# Altium project SOMO_PowerPack_Top.PrjPcb
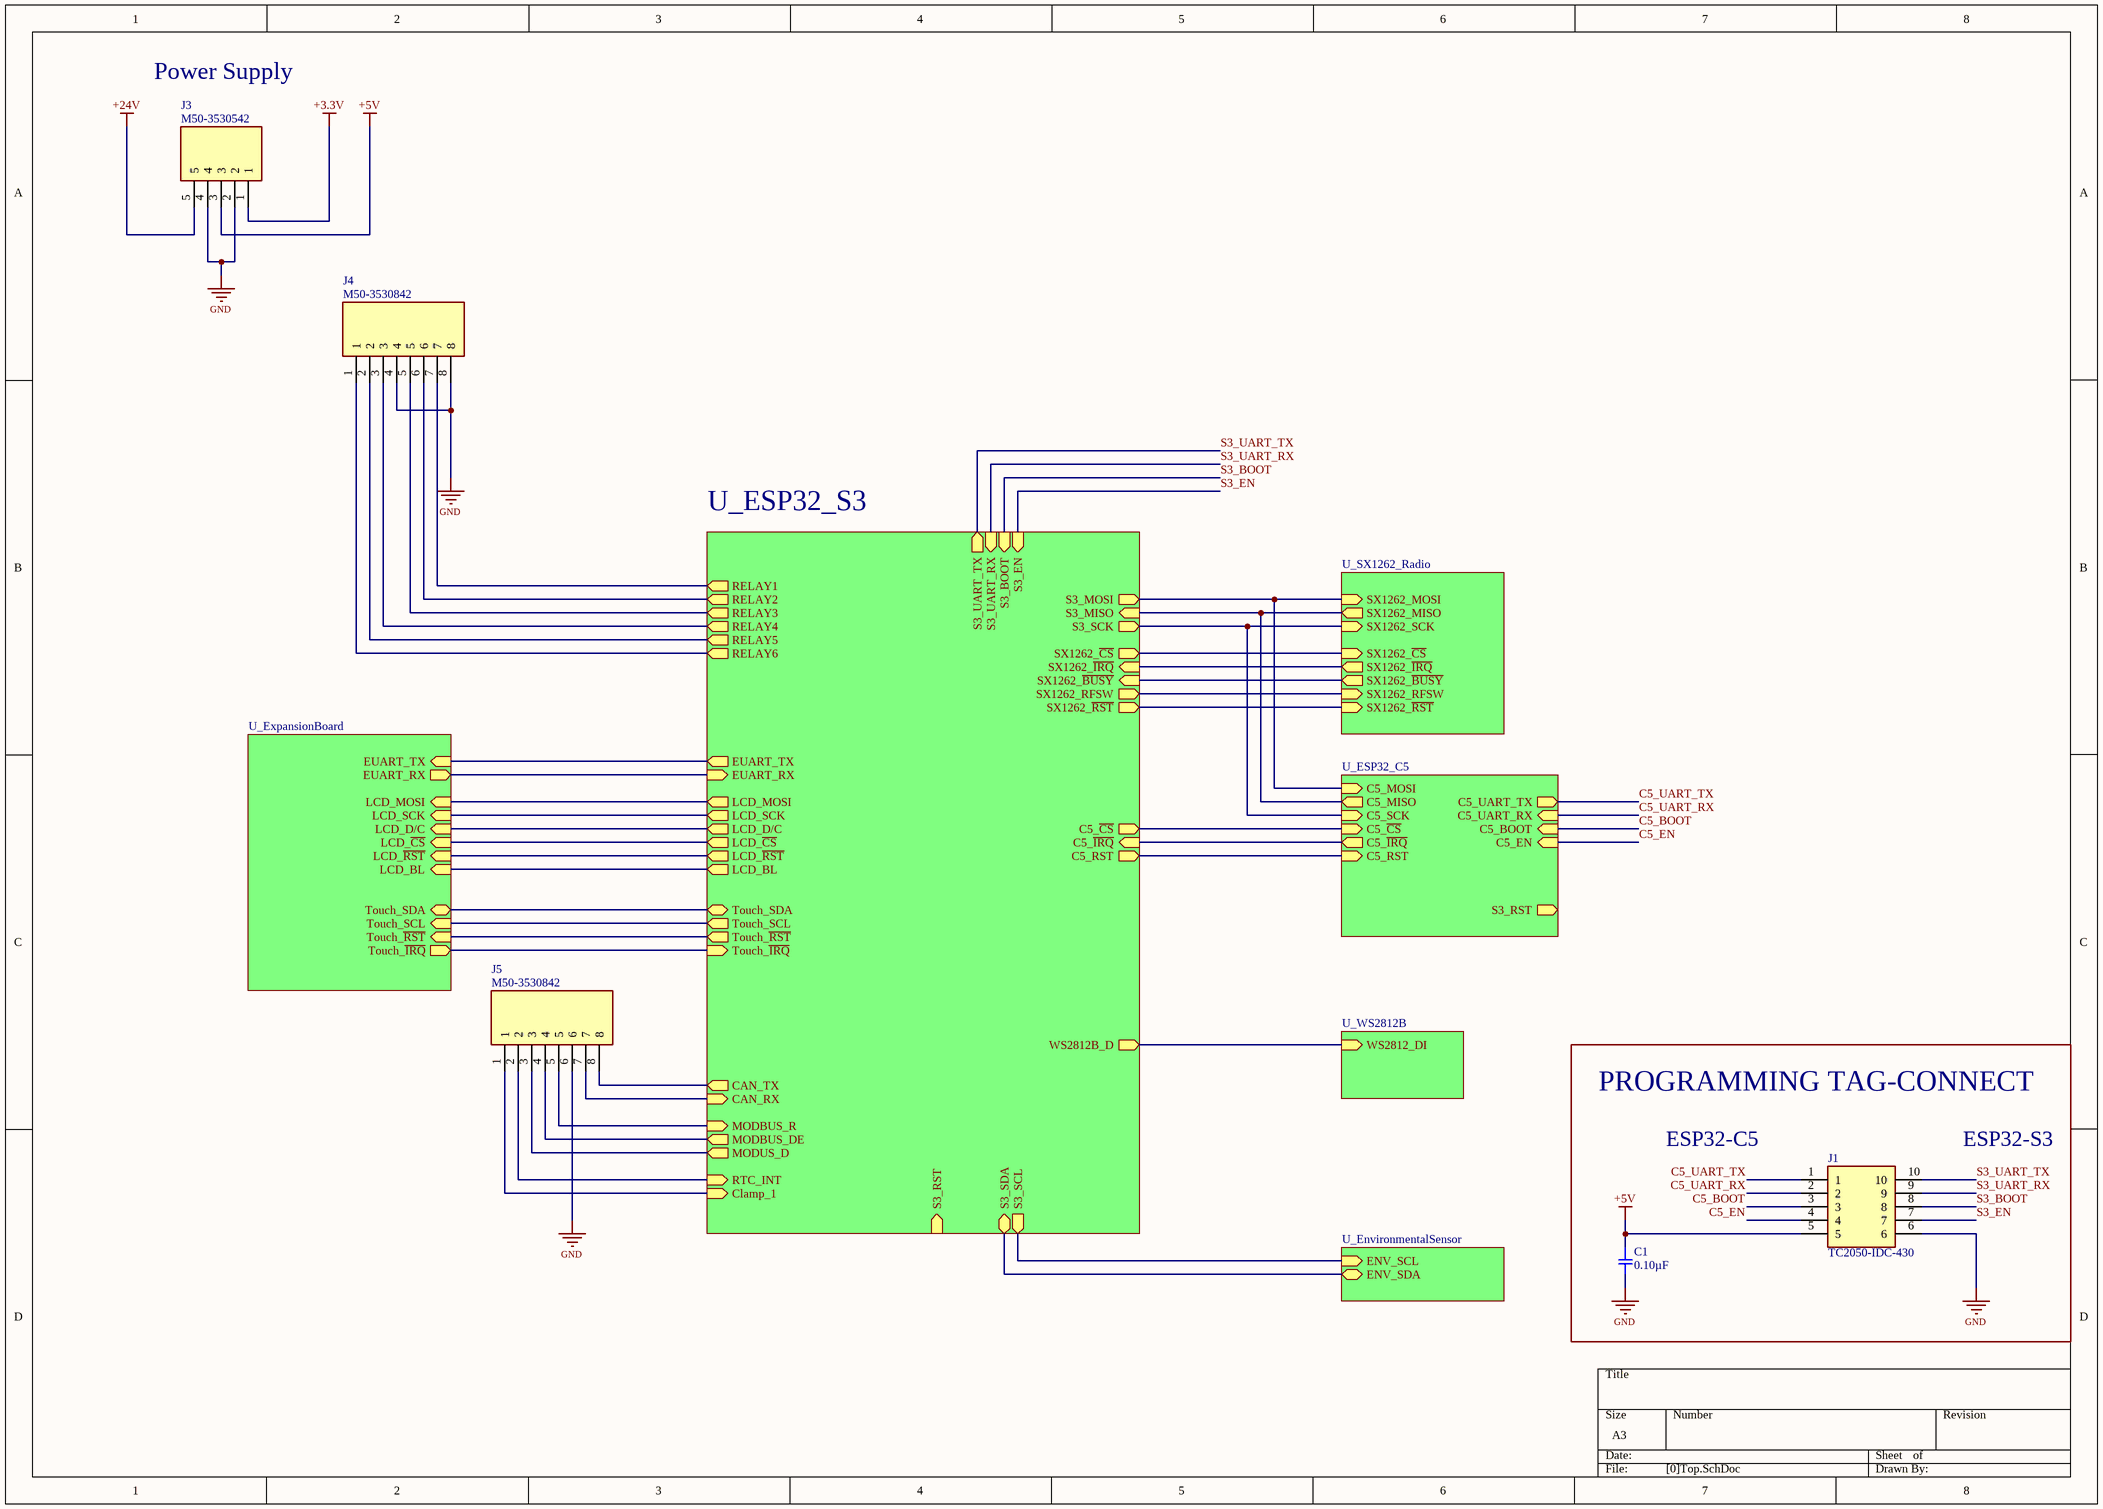
[diagram p0: [0]Top.SchDoc]
9 sheets, 47 parts. Net scope: hierarchical (ports join the sheet entries above them; power ports are global).
Board file: SOMO_PowerPack_Top.PcbDoc
Sheets:
  [0]Top.SchDoc
    U_ESP32_C5 = ESP32_C5.SchDoc
    U_ESP32_S3 = ESP32_S3.SchDoc
      U_GPIO_Expander = GPIO_Expander.SchDoc
    U_SX1262_Radio = SX1262_Radio.SchDoc
    U_ExpansionBoard = ExpansionBoard.SchDoc
    U_WS2812B = WS2812B.SchDoc
    U_EnvironmentalSensor = EnvironmentalSensor.SchDoc
  GPIO_Expander2.SchDoc

## Sheet [0]Top.SchDoc
size A3; SheetNumber: 1; SheetTotal: 8

### Parts
C1  0.10µF  [SMD-0402C]
J1  TC2050-IDC-430  [TC2050-IDC]  (no BOM)
J3  M50-3530542  [HDRV5W40P0X127_1X5_635X210X400P]
J4  M50-3530842  [HDRV8W40P0X127_1X8_1016X210X400P]
J5  M50-3530842  [HDRV8W40P0X127_1X8_1016X210X400P]

### Blocks framed on the sheet
PROGRAMMING TAG-CONNECT: C1 J1

### Sub-sheets
U_EnvironmentalSensor = EnvironmentalSensor.SchDoc: ENV_SCL (in), ENV_SDA (bidir)
U_ESP32_C5 = ESP32_C5.SchDoc: C5_UART_TX (out), S3_RST (out), C5_MOSI (in), C5_MISO (out), C5_SCK (in), C5_~{CS} (in), C5_RST (in), C5_UART_RX (in), C5_BOOT (in), C5_EN (in), C5_~{IRQ} (out)
U_ESP32_S3 = ESP32_S3.SchDoc: Touch_SDA (bidir), Touch_SCL (out), S3_SDA (bidir), EUART_TX (out), EUART_RX (in), LCD_MOSI (out), Touch_~{IRQ} (in), LCD_SCK (out), RELAY1 (out), RELAY2 (out), RELAY3 (out), RELAY4 (out), RELAY5 (out), RELAY6 (out), LCD_~{CS} (out), LCD_D/C (out), LCD_~{RST} (out), Touch_~{RST} (out), LCD_BL (out), S3_MOSI (out), S3_MISO (in), S3_SCK (out), SX1262_~{CS} (out), SX1262_~{IRQ} (in), SX1262_RFSW (out), SX1262_~{RST} (out), S3_UART_TX (out), S3_UART_RX (in), S3_BOOT (in), S3_EN (in), S3_SCL (out), WS2812B_D (out), SX1262_~{BUSY} (in), S3_RST (in), C5_~{CS} (out), C5_~{IRQ} (in), C5_RST (out), CAN_TX (out), CAN_RX (in), MODUS_D (out), MODBUS_DE (out), MODBUS_R (in), RTC_INT (in), Clamp_1 (in)
U_ExpansionBoard = ExpansionBoard.SchDoc: LCD_MOSI (in), EUART_RX (out), EUART_TX (in), LCD_SCK (in), LCD_D/C (in), LCD_~{CS} (in), LCD_~{RST} (in), LCD_BL (in), Touch_~{IRQ} (out), Touch_~{RST} (in), Touch_SCL (in), Touch_SDA (bidir)
U_SX1262_Radio = SX1262_Radio.SchDoc: SX1262_SCK (in), SX1262_MOSI (in), SX1262_MISO (out), SX1262_~{CS} (in), SX1262_~{IRQ} (out), SX1262_RFSW (in), SX1262_~{RST} (in), SX1262_~{BUSY} (out)
U_WS2812B = WS2812B.SchDoc: WS2812_DI (in)

### Nets
+3.3V: J3.1
+5V: C1.1 J1.5 J3.3
+24V: J3.5
GND: C1.2 J1.6 J3.2 J3.4 J4.4 J4.8 J5.6
C5_BOOT: J1.3 ; sheet U_ESP32_C5/C5_BOOT
C5_~{CS}: sheet U_ESP32_C5/C5_~{CS}, sheet U_ESP32_S3/C5_~{CS}
C5_EN: J1.4 ; sheet U_ESP32_C5/C5_EN
C5_~{IRQ}: sheet U_ESP32_C5/C5_~{IRQ}, sheet U_ESP32_S3/C5_~{IRQ}
C5_RST: sheet U_ESP32_C5/C5_RST, sheet U_ESP32_S3/C5_RST
C5_UART_RX: J1.2 ; sheet U_ESP32_C5/C5_UART_RX
C5_UART_TX: J1.1 ; sheet U_ESP32_C5/C5_UART_TX
CAN_RX: J5.7 ; sheet U_ESP32_S3/CAN_RX
CAN_TX: J5.8 ; sheet U_ESP32_S3/CAN_TX
Clamp_1: J5.1 ; sheet U_ESP32_S3/Clamp_1
EUART_RX: sheet U_ESP32_S3/EUART_RX, sheet U_ExpansionBoard/EUART_RX
EUART_TX: sheet U_ESP32_S3/EUART_TX, sheet U_ExpansionBoard/EUART_TX
LCD_BL: sheet U_ESP32_S3/LCD_BL, sheet U_ExpansionBoard/LCD_BL
LCD_~{CS}: sheet U_ESP32_S3/LCD_~{CS}, sheet U_ExpansionBoard/LCD_~{CS}
LCD_D/C: sheet U_ESP32_S3/LCD_D/C, sheet U_ExpansionBoard/LCD_D/C
LCD_MOSI: sheet U_ESP32_S3/LCD_MOSI, sheet U_ExpansionBoard/LCD_MOSI
LCD_~{RST}: sheet U_ESP32_S3/LCD_~{RST}, sheet U_ExpansionBoard/LCD_~{RST}
LCD_SCK: sheet U_ESP32_S3/LCD_SCK, sheet U_ExpansionBoard/LCD_SCK
MODBUS_D: J5.3 ; sheet U_ESP32_S3/MODUS_D
MODBUS_DE: J5.4 ; sheet U_ESP32_S3/MODBUS_DE
MODBUS_R: J5.5 ; sheet U_ESP32_S3/MODBUS_R
RELAY1: J4.7 ; sheet U_ESP32_S3/RELAY1
RELAY2: J4.6 ; sheet U_ESP32_S3/RELAY2
RELAY3: J4.5 ; sheet U_ESP32_S3/RELAY3
RELAY4: J4.3 ; sheet U_ESP32_S3/RELAY4
RELAY5: J4.2 ; sheet U_ESP32_S3/RELAY5
RELAY6: J4.1 ; sheet U_ESP32_S3/RELAY6
RTC_INT: J5.2 ; sheet U_ESP32_S3/RTC_INT
S3_BOOT: J1.8 ; sheet U_ESP32_S3/S3_BOOT
S3_EN: J1.7 ; sheet U_ESP32_S3/S3_EN
S3_MISO: sheet U_ESP32_C5/C5_MISO, sheet U_ESP32_S3/S3_MISO, sheet U_SX1262_Radio/SX1262_MISO
S3_MOSI: sheet U_ESP32_C5/C5_MOSI, sheet U_ESP32_S3/S3_MOSI, sheet U_SX1262_Radio/SX1262_MOSI
S3_SCK: sheet U_ESP32_C5/C5_SCK, sheet U_ESP32_S3/S3_SCK, sheet U_SX1262_Radio/SX1262_SCK
S3_SCL: sheet U_ESP32_S3/S3_SCL, sheet U_EnvironmentalSensor/ENV_SCL
S3_SDA: sheet U_ESP32_S3/S3_SDA, sheet U_EnvironmentalSensor/ENV_SDA
S3_UART_RX: J1.9 ; sheet U_ESP32_S3/S3_UART_RX
S3_UART_TX: J1.10 ; sheet U_ESP32_S3/S3_UART_TX
SX1262_~{BUSY}: sheet U_ESP32_S3/SX1262_~{BUSY}, sheet U_SX1262_Radio/SX1262_~{BUSY}
SX1262_~{CS}: sheet U_ESP32_S3/SX1262_~{CS}, sheet U_SX1262_Radio/SX1262_~{CS}
SX1262_~{IRQ}: sheet U_ESP32_S3/SX1262_~{IRQ}, sheet U_SX1262_Radio/SX1262_~{IRQ}
SX1262_~{RST}: sheet U_ESP32_S3/SX1262_~{RST}, sheet U_SX1262_Radio/SX1262_~{RST}
SX1262_RFSW: sheet U_ESP32_S3/SX1262_RFSW, sheet U_SX1262_Radio/SX1262_RFSW
Touch_~{IRQ}: sheet U_ESP32_S3/Touch_~{IRQ}, sheet U_ExpansionBoard/Touch_~{IRQ}
Touch_~{RST}: sheet U_ESP32_S3/Touch_~{RST}, sheet U_ExpansionBoard/Touch_~{RST}
Touch_SCL: sheet U_ESP32_S3/Touch_SCL, sheet U_ExpansionBoard/Touch_SCL
Touch_SDA: sheet U_ESP32_S3/Touch_SDA, sheet U_ExpansionBoard/Touch_SDA
WS2812B_D: sheet U_ESP32_S3/WS2812B_D, sheet U_WS2812B/WS2812_DI

### Notes on the sheet
- Power Supply
- ESP32-C5
- ESP32-S3

### Library data of the parts
C1 = GCM155R71C104KA55D: CAP CER 0.1UF 16V X7R 0402; Manufacturer: Murata Electronics North America; Factory Stock: 0; Unit Price (USD): 0.1; Minimum Quantity: 1; Tolerance: ±10%; Datasheets: http://www.murata.com/~/media/webrenewal/support/library/catalog/products/capacitor/mlcc/c03e.ashx; Image: //media.digikey.com/Renders/Murata%20Renders/ZRB-SERIES-0402.jpg; Digi-Key Part Number: 490-4759-1-ND; Part Number: GCM155R71C104KA55D; Quantity Available: 734194; @ qty: 0; Packaging: Cut Tape (CT); Series: GCM; Part Status: Active; Value: 0.10µF; Voltage: 16V; Temperature Coefficient: X7R; Operating Temperature: -55°C ~ 125°C; Features: -; Ratings: AEC-Q200; Applications: Automotive; Mounting Type: Surface Mount, MLCC; Package / Case: 0402 (1005 Metric); Size / Dimension: 0.039" L x 0.020" W (1.00mm x 0.50mm); Height - Seated (Max): -; Thickness (Max): 0.022" (0.55mm); Lead Spacing: -; Lead Style: -
J1 = TC2050-IDC-430: Connector; Manufacturer_Name: Tag Connect; Datasheet Link: https://datasheet.datasheetarchive.com/originals/distributors/Datasheets_SAMA/8a7b9a42a753a5cbaca4256ee093e59c.pdf; Manufacturer_Part_Number: TC2050-IDC-430
J3 = M50-3530542: Connector; Manufacturer_Name: Harwin; Datasheet Link: https://content.harwin.com/m/b82244d701975b38/original/DRG-02646-Technical-Drawing-Datasheet-M50-353-pdf.pdf; Height: 4mm; Manufacturer_Part_Number: M50-3530542; Mouser Part Number: 855-M50-3530542; Mouser Price/Stock: https://www.mouser.co.uk/ProductDetail/Harwin/M50-3530542?qs=%252BdQmOuGyFcHDSISYjHIhxg%3D%3D
J4 J5 = M50-3530842: Connector; Manufacturer_Name: Harwin; Datasheet Link: https://content.harwin.com/m/b82244d701975b38/original/DRG-02646-Technical-Drawing-Datasheet-M50-353-pdf.pdf; Height: 4mm; Manufacturer_Part_Number: M50-3530842; Mouser Part Number: 855-M50-3530842; Mouser Price/Stock: https://www.mouser.co.uk/ProductDetail/Harwin/M50-3530842?qs=%252BdQmOuGyFcHKRmyiVqsSSw%3D%3D

## Sheet ESP32_C5.SchDoc
size A4; SheetNumber: 2; SheetTotal: 7
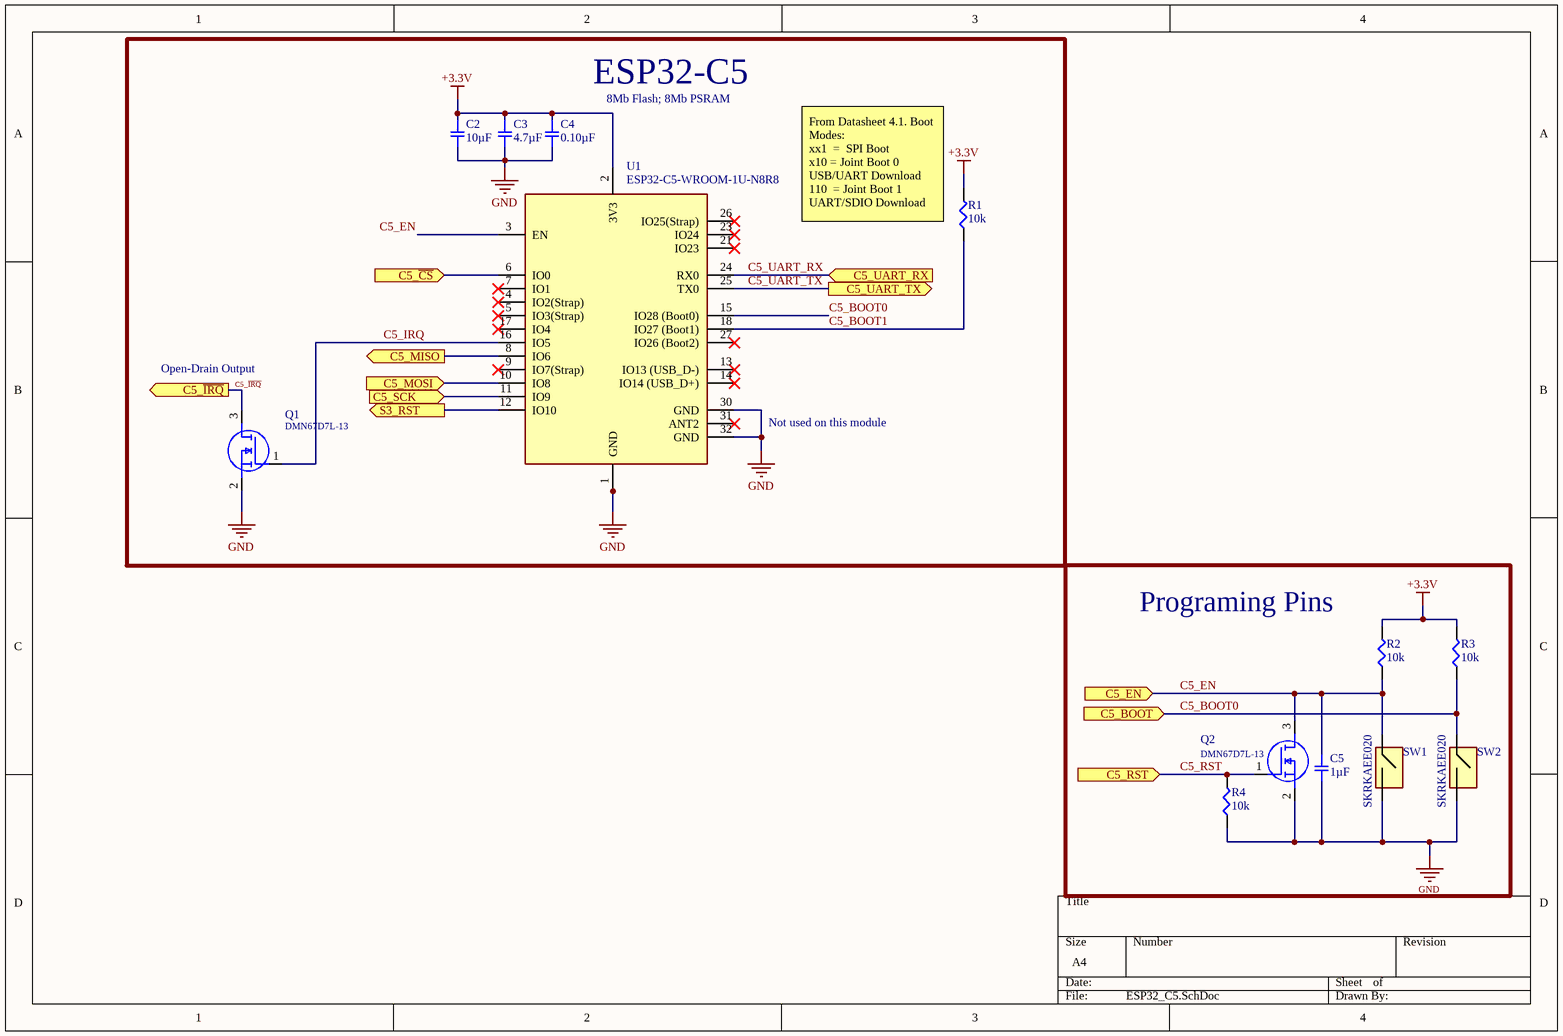
[diagram p1: ESP32_C5.SchDoc]

### Parts
C2  10µF  [SMD-0603C]
C3  4.7µF  [SMD-0402C]
C4  0.10µF  [SMD-0402C]
C5  1µF  [SMD-0402C]
Q1  DMN67D7L-13  [DMN67D7L13]
Q2  DMN67D7L-13  [DMN67D7L13]
R1  10k  [SMD-0402-RES]
R2  10k  [SMD-0402-RES]
R3  10k  [SMD-0402-RES]
R4  10k  [SMD-0402-RES]
SW1  SKRKAEE020  [SKRKAEE020]
SW2  SKRKAEE020  [SKRKAEE020]
U1  ESP32-C5-WROOM-1U-N8R8  [ESP32C5WROOM1UN8R8]

### Blocks framed on the sheet
ESP32-C5: C2-C4 Q1 R1 U1
Programing Pins: C5 Q2 R2-R4 SW1 SW2

### Ports
C5_BOOT (in), C5_EN (in), C5_MISO (out), C5_MOSI (in), C5_RST (in), C5_SCK (in), C5_UART_RX (in), C5_UART_TX (out), C5_~{CS} (in), C5_~{IRQ} (out), S3_RST (out)

### Nets
+3.3V: C2.1 C3.1 C4.1 R1.2 R2.2 R3.2 U1.2(3V3)
GND: C2.2 C3.2 C4.2 C5.2 Q1.2(S) Q2.2(S) R4.1 SW1.2 SW2.2 U1.1(GND) U1.28(GND) U1.29(GND) U1.30(GND) U1.32(GND)
C5_BOOT0: R3.1 SW2.1 U1.15(IO28_(Boot0)) ; port C5_BOOT  [project net C5_BOOT]
C5_BOOT1: R1.1 U1.18(IO27_(Boot1))
C5_~{CS}: U1.6(IO0) ; port C5_~{CS}
C5_EN: C5.1 Q2.3(D) R2.1 SW1.1 U1.3(EN) ; port C5_EN
C5_~{IRQ}: Q1.3(D) ; port C5_~{IRQ}
C5_IRQ: Q1.1(G) U1.16(IO5)
C5_RST: Q2.1(G) R4.2 ; port C5_RST
C5_UART_RX: U1.24(RX0) ; port C5_UART_RX
C5_UART_TX: U1.25(TX0) ; port C5_UART_TX
S3_MISO: U1.8(IO6) ; port C5_MISO
S3_MOSI: U1.10(IO8) ; port C5_MOSI
S3_SCK: U1.11(IO9) ; port C5_SCK
NetU1_12: U1.12(IO10) ; port S3_RST

Not connected (* = marked no-connect by the designer): U1 4(IO2(Strap))* 5(IO3(Strap))* 7(IO1)* 9(IO7(Strap))* 13(IO13_(USB_D-))* 14(IO14_(USB_D+))* 17(IO4)* 19(NC/IO15) 20(NC_1) 21(IO23)* 22(NC_2) 23(IO24)* 26(IO25(Strap))* 27(IO26_(Boot2))* 31(ANT2)*

### Notes on the sheet
- 8Mb Flash; 8Mb PSRAM
- (near R1) From Datasheet 4.1. Boot Modes:
  xx1  =  SPI Boot
  x10 = Joint Boot 0 USB/UART Download
  110  = Joint Boot 1 UART/SDIO Download
- (near Q1) Open-Drain Output
- Not used on this module

### Library data of the parts
C2 = GRM185R60J106ME15D: CAP CER 10UF 6.3V X5R 0603; Manufacturer: Murata Electronics North America; Factory Stock: 0; Unit Price (USD): 0.36; Minimum Quantity: 1; Tolerance: ±20%; Datasheets: http://www.murata.com/~/media/webrenewal/support/library/catalog/products/capacitor/mlcc/c02e.pdf; Image: //media.digikey.com/Renders/Murata%20Renders/ZRB-SERIES-0402.jpg; Digi-Key Part Number: 490-10467-1-ND; Part Number: GRM185R60J106ME15D; Quantity Available: 25068; @ qty: 0; Packaging: Cut Tape (CT); Series: GRM; Part Status: Active; Value: 10µF; Voltage: 6.3V; Temperature Coefficient: X5R; Operating Temperature: -55°C ~ 85°C; Features: Derating Recommended; Ratings: -; Applications: General Purpose; Mounting Type: Surface Mount, MLCC; Package / Case: 0603 (1608 Metric); Size / Dimension: 0.063" L x 0.031" W (1.60mm x 0.80mm); Height - Seated (Max): -; Thickness (Max): 0.022" (0.55mm); Lead Spacing: -; Lead Style: -
C3 = GRM153R60J475ME15D: CAP CER 4.7UF 6.3V X5R 0402; Manufacturer: Murata Electronics North America; Factory Stock: 0; Unit Price (USD): 0.27; Minimum Quantity: 1; Tolerance: ±20%; Datasheets: http://psearch.en.murata.com/capacitor/product/GRM153R60J475ME15%23.pdf; Image: //media.digikey.com/Renders/Murata%20Renders/ZRB-SERIES-0402.jpg; Digi-Key Part Number: 490-13232-1-ND; Part Number: GRM153R60J475ME15D; Quantity Available: 30412; @ qty: 0; Packaging: Cut Tape (CT); Series: GRM; Part Status: Active; Value: 4.7µF; Voltage: 6.3V; Temperature Coefficient: X5R; Operating Temperature: -55°C ~ 85°C; Features: Derating Recommended; Ratings: -; Applications: General Purpose; Mounting Type: Surface Mount, MLCC; Package / Case: 0402 (1005 Metric); Size / Dimension: 0.039" L x 0.020" W (1.00mm x 0.50mm); Height - Seated (Max): -; Thickness (Max): 0.013" (0.33mm); Lead Spacing: -; Lead Style: -
C4 = GCM155R71C104KA55D: as C1 on sheet [0]Top; Datasheets: http://www.murata.com/~/media/webrenewal/support/library/catalog/products/capacitor/mlcc/c03e.ashx; Image: //media.digikey.com/Renders/Murata%20Renders/ZRB-SERIES-0402.jpg; Digi-Key Part Number: 490-4759-1-ND; Part Number: GCM155R71C104KA55D; Quantity Available: 734194; @ qty: 0; Packaging: Cut Tape (CT); Series: GCM; Part Status: Active; Value: 0.10µF; Voltage: 16V; Temperature Coefficient: X7R; Operating Temperature: -55°C ~ 125°C; Features: -; Ratings: AEC-Q200; Applications: Automotive; Mounting Type: Surface Mount, MLCC; Package / Case: 0402 (1005 Metric); Size / Dimension: 0.039" L x 0.020" W (1.00mm x 0.50mm); Height - Seated (Max): -; Thickness (Max): 0.022" (0.55mm); Lead Spacing: -; Lead Style: -
C5 = GCM155C71A105KE38D: CAP CER 1UF 10V X7S 0402; Manufacturer: Murata Electronics North America; Factory Stock: 0; Unit Price (USD): 0.12; Minimum Quantity: 1; Tolerance: ±10%; Datasheets: http://www.murata.com/~/media/webrenewal/support/library/catalog/products/capacitor/mlcc/c03e.ashx; Image: //media.digikey.com/Renders/Murata%20Renders/ZRB-SERIES-0402.jpg; Digi-Key Part Number: 490-13409-1-ND; Part Number: GCM155C71A105KE38D; Quantity Available: 7240; @ qty: 0; Packaging: Cut Tape (CT); Series: GCM; Part Status: Active; Value: 1µF; Voltage: 10V; Temperature Coefficient: X7S; Operating Temperature: -55°C ~ 125°C; Features: -; Ratings: AEC-Q200; Applications: Automotive; Mounting Type: Surface Mount, MLCC; Package / Case: 0402 (1005 Metric); Size / Dimension: 0.039" L x 0.020" W (1.00mm x 0.50mm); Height - Seated (Max): -; Thickness (Max): 0.022" (0.55mm); Lead Spacing: -; Lead Style: -
Q1 Q2 = DMN67D7L-13: MOSFET (N-Channel); Manufacturer_Name: Diodes Incorporated; Datasheet Link: https://www.diodes.com/assets/Package-Files/SOT23.pdf; Height: 1.1mm; Manufacturer_Part_Number: DMN67D7L-13; Mouser Part Number: 621-DMN67D7L-13; Mouser Price/Stock: https://www.mouser.co.uk/ProductDetail/Diodes-Incorporated/DMN67D7L-13?qs=W0yvOO0ixfHR5TrLcSFuNw%3D%3D; Arrow Part Number: DMN67D7L-13; Arrow Price/Stock: https://www.arrow.com/en/products/dmn67d7l-13/diodes-incorporated?region=nac; Value: DMN67D7L-13
R1-R4 = ERJ-2RKF1002X: RES SMD 10K OHM 1% 1/10W 0402; Manufacturer: Panasonic Electronic Components; Factory Stock: 0; Unit Price (USD): 0.00496; @ qty: 1500; Minimum Quantity: 1; Power (Watts): 0.1W, 1/10W; Temperature Coefficient: ±100ppm/°C; Part Number: ERJ-2RKF1002X; Datasheets: http://industrial.panasonic.com/www-cgi/jvcr13pz.cgi?E+PZ+3+AOA0002+ERJ2RKF1002X+7+WW; Image: //media.digikey.com/Photos/Panasonic%20Photos/ERJ-PA2-Series.jpg; Digi-Key Part Number: P10.0KLCT-ND; Quantity Available: 9922786; Packaging: Cut Tape (CT); Series: ERJ; Part Status: Active; Value: 10k; Tolerance: ±1%; Composition: Thick Film; Features: Automotive AEC-Q200; Operating Temperature: -55°C ~ 155°C; Package / Case: 0402 (1005 Metric); Supplier Device Package: 0402; Size / Dimension: 0.039" L x 0.020" W (1.00mm x 0.50mm); Height - Seated (Max): 0.016" (0.40mm); Number of Terminations: 2; Failure Rate: -
SW1 SW2 = SKRKAEE020: Tactile Switches 3.9x2.9x2.0mm 160gf Packaging Temp 80oC; Manufacturer_Name: ALPS Electric; Datasheet Link: http://www.alps.com/prod/info/J/HTML/Tact/SurfaceMount/SKRK/SKRKAEE020.html; Height: 2mm; Manufacturer_Part_Number: SKRKAEE020; Mouser Part Number: 688-SKRKAEE020; Mouser Price/Stock: https://www.mouser.co.uk/ProductDetail/Alps-Alpine/SKRKAEE020?qs=MrosSN5%252BUQW89XjXIp8Ugw%3D%3D; Value: SKRKAEE020
U1 = ESP32-C5-WROOM-1U-N8R8: Integrated Circuit; Manufacturer_Name: Espressif Systems; Manufacturer_Part_Number: ESP32-C5-WROOM-1-N8R8; Datasheet Link: https://documentation.espressif.com/esp32-c5-wroom-1_wroom-1u_datasheet_en.pdf; Height: 3.45mm; Value: ESP32-C5-WROOM-1U-N8R8

## Sheet ESP32_S3.SchDoc
size A4; SheetNumber: 3; SheetTotal: 8
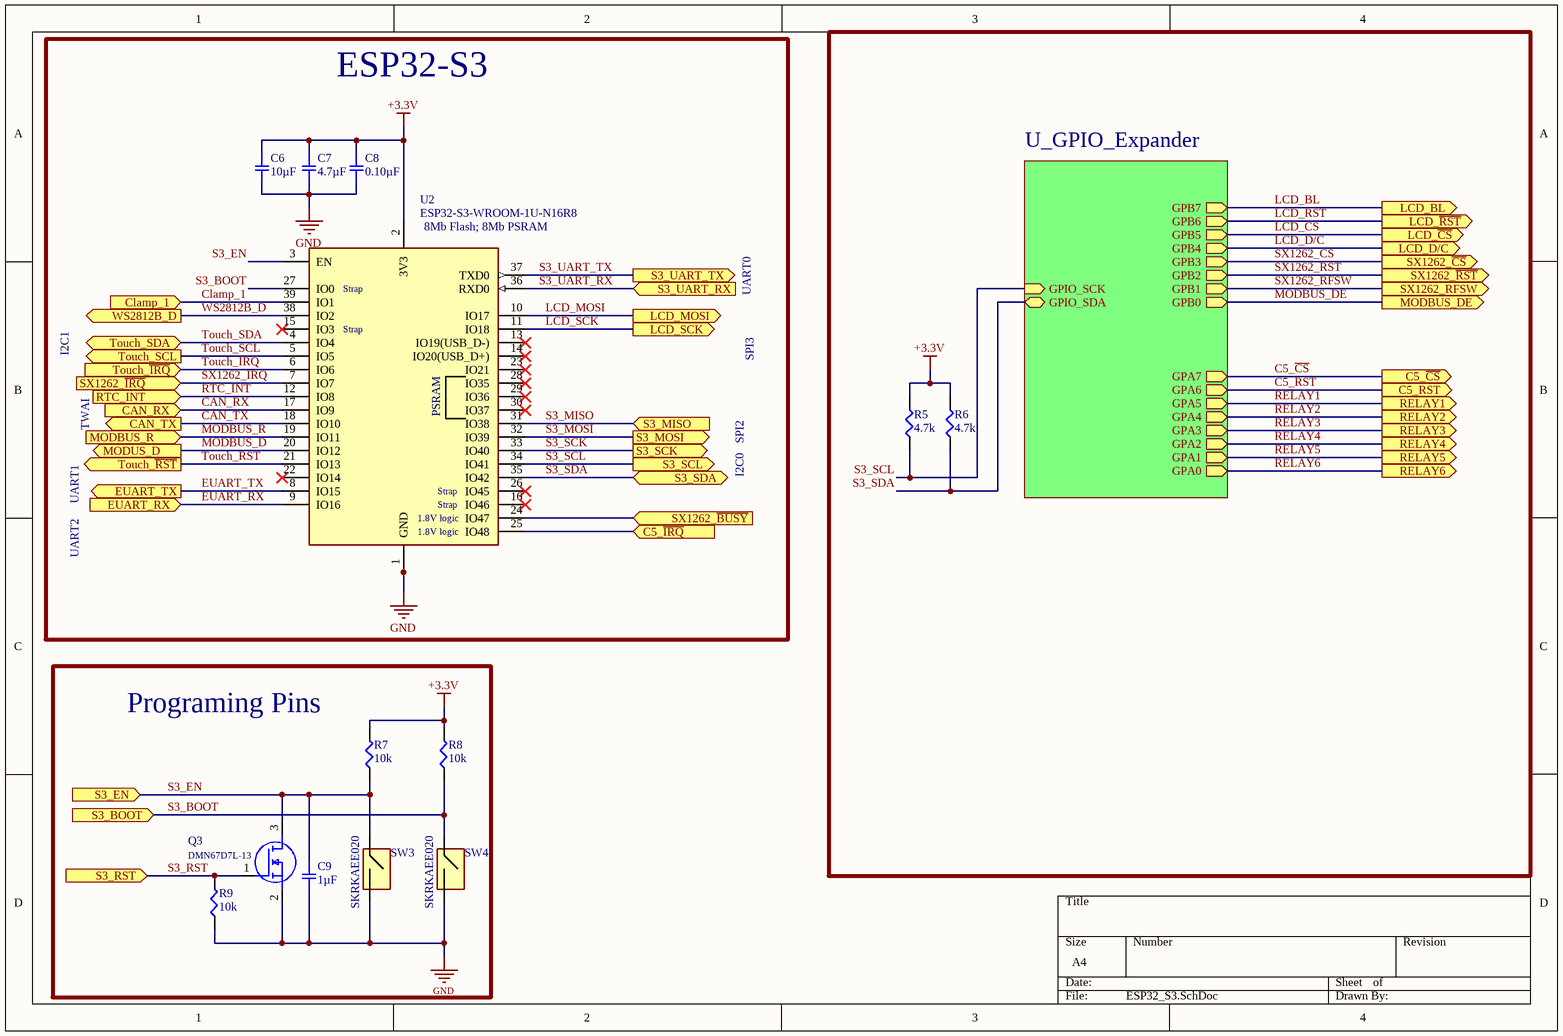
[diagram p2: ESP32_S3.SchDoc]

### Parts
C6  10µF  [SMD-0603C]
C7  4.7µF  [SMD-0402C]
C8  0.10µF  [SMD-0402C]
C9  1µF  [SMD-0402C]
Q3  DMN67D7L-13  [DMN67D7L13]
R5  4.7k  [SMD-0402-RES]
R6  4.7k  [SMD-0402-RES]
R7  10k  [SMD-0402-RES]
R8  10k  [SMD-0402-RES]
R9  10k  [SMD-0402-RES]
SW3  SKRKAEE020  [SKRKAEE020]
SW4  SKRKAEE020  [SKRKAEE020]
U2  ESP32-S3-WROOM-1U-N16R8  [ESP32S3WROOM1UN16R8]

### Blocks framed on the sheet
ESP32-S3: C6-C8 U2
Programing Pins: C9 Q3 R7-R9 SW3 SW4

### Sub-sheets
U_GPIO_Expander = GPIO_Expander.SchDoc: GPB7 (out), GPB6 (out), GPB5 (out), GPB4 (out), GPB3 (out), GPB2 (out), GPB1 (out), GPB0 (out), GPA0 (out), GPA1 (out), GPA2 (out), GPA3 (out), GPA4 (out), GPA5 (out), GPA6 (out), GPA7 (out), GPIO_SCK (in), GPIO_SDA (bidir)

### Ports
C5_RST (out), C5_~{CS} (out), C5_~{IRQ} (in), CAN_RX (in), CAN_TX (out), Clamp_1 (in), EUART_RX (in), EUART_TX (out), LCD_BL (out), LCD_D/C (out), LCD_MOSI (out), LCD_SCK (out), LCD_~{CS} (out), LCD_~{RST} (out), MODBUS_DE (out), MODBUS_R (in), MODUS_D (out), RELAY1 (out), RELAY2 (out), RELAY3 (out), RELAY4 (out), RELAY5 (out), RELAY6 (out), RTC_INT (in), S3_BOOT (in), S3_EN (in), S3_MISO (in), S3_MOSI (out), S3_RST (in), S3_SCK (out), S3_SCL (out), S3_SDA (bidir), S3_UART_RX (in), S3_UART_TX (out), SX1262_RFSW (out), SX1262_~{BUSY} (in), SX1262_~{CS} (out), SX1262_~{IRQ} (in), SX1262_~{RST} (out), Touch_SCL (out), Touch_SDA (bidir), Touch_~{IRQ} (in), Touch_~{RST} (out), WS2812B_D (out)

### Nets
+3.3V: C6.1 C7.1 C8.1 R5.2 R6.2 R7.2 R8.2 U2.2(3V3)
GND: C6.2 C7.2 C8.2 C9.2 Q3.2(S) R9.1 SW3.2 SW4.2 U2.1(GND) U2.40(GND) U2.41(GND) U2.42(GND) U2.43(GND) U2.44(GND) U2.45(GND) U2.46(GND) U2.47(GND) U2.48(GND) U2.49(GND)
C5_~{CS}: port C5_~{CS}, sheet U_GPIO_Expander/GPA7
C5_~{IRQ}: U2.25(IO48) ; port C5_~{IRQ}
C5_RST: port C5_RST, sheet U_GPIO_Expander/GPA6
CAN_RX: U2.17(IO9) ; port CAN_RX
CAN_TX: U2.18(IO10) ; port CAN_TX
Clamp_1: U2.39(IO1) ; port Clamp_1
EUART_RX: U2.9(IO16) ; port EUART_RX
EUART_TX: U2.8(IO15) ; port EUART_TX
LCD_BL: port LCD_BL, sheet U_GPIO_Expander/GPB7
LCD_~{CS}: port LCD_~{CS}, sheet U_GPIO_Expander/GPB5
LCD_D/C: port LCD_D/C, sheet U_GPIO_Expander/GPB4
LCD_MOSI: U2.10(IO17) ; port LCD_MOSI
LCD_~{RST}: port LCD_~{RST}, sheet U_GPIO_Expander/GPB6
LCD_SCK: U2.11(IO18) ; port LCD_SCK
MODBUS_D: U2.20(IO12) ; port MODUS_D
MODBUS_DE: port MODBUS_DE, sheet U_GPIO_Expander/GPB0
MODBUS_R: U2.19(IO11) ; port MODBUS_R
RELAY1: port RELAY1, sheet U_GPIO_Expander/GPA5
RELAY2: port RELAY2, sheet U_GPIO_Expander/GPA4
RELAY3: port RELAY3, sheet U_GPIO_Expander/GPA3
RELAY4: port RELAY4, sheet U_GPIO_Expander/GPA2
RELAY5: port RELAY5, sheet U_GPIO_Expander/GPA1
RELAY6: port RELAY6, sheet U_GPIO_Expander/GPA0
RTC_INT: U2.12(IO8) ; port RTC_INT
S3_BOOT: R8.1 SW4.1 U2.27(IO0) ; port S3_BOOT
S3_EN: C9.1 Q3.3(D) R7.1 SW3.1 U2.3(EN) ; port S3_EN
S3_MISO: U2.31(IO38) ; port S3_MISO
S3_MOSI: U2.32(IO39) ; port S3_MOSI
S3_RST: Q3.1(G) R9.2 ; port S3_RST
S3_SCK: U2.33(IO40) ; port S3_SCK
S3_SCL: R5.1 U2.34(IO41) ; port S3_SCL, sheet U_GPIO_Expander/GPIO_SCK
S3_SDA: R6.1 U2.35(IO42) ; port S3_SDA, sheet U_GPIO_Expander/GPIO_SDA
S3_UART_RX: U2.36(RXD0) ; port S3_UART_RX
S3_UART_TX: U2.37(TXD0) ; port S3_UART_TX
SX1262_~{BUSY}: U2.24(IO47) ; port SX1262_~{BUSY}
SX1262_~{CS}: port SX1262_~{CS}, sheet U_GPIO_Expander/GPB3
SX1262_~{IRQ}: U2.7(IO7) ; port SX1262_~{IRQ}
SX1262_~{RST}: port SX1262_~{RST}, sheet U_GPIO_Expander/GPB2
SX1262_RFSW: port SX1262_RFSW, sheet U_GPIO_Expander/GPB1
Touch_~{IRQ}: U2.6(IO6) ; port Touch_~{IRQ}
Touch_~{RST}: U2.21(IO13) ; port Touch_~{RST}
Touch_SCL: U2.5(IO5) ; port Touch_SCL
Touch_SDA: U2.4(IO4) ; port Touch_SDA
WS2812B_D: U2.38(IO2) ; port WS2812B_D

Not connected (* = marked no-connect by the designer): U2 13(IO19(USB_D-))* 14(IO20(USB_D+))* 15(IO3)* 16(IO46)* 22(IO14)* 23(IO21)* 26(IO45)* 28(IO35)* 29(IO36)* 30(IO37)*

### Notes on the sheet
- (near U2) 8Mb Flash; 8Mb PSRAM
- (near U2) Strap
- UART0
- I2C1
- SPI3
- TWAI
- SPI2
- UART1
- UART2
- (near U2) 1.8V logic
- I2C0
- (in symbol ESP32-S3-WROOM-1U-N16R8) PSRAM

### Library data of the parts
C6 = GRM185R60J106ME15D: as C2 on sheet ESP32_C5; Datasheets: http://www.murata.com/~/media/webrenewal/support/library/catalog/products/capacitor/mlcc/c02e.pdf; Image: //media.digikey.com/Renders/Murata%20Renders/ZRB-SERIES-0402.jpg; Digi-Key Part Number: 490-10467-1-ND; Part Number: GRM185R60J106ME15D; Quantity Available: 25068; @ qty: 0; Packaging: Cut Tape (CT); Series: GRM; Part Status: Active; Value: 10µF; Voltage: 6.3V; Temperature Coefficient: X5R; Operating Temperature: -55°C ~ 85°C; Features: Derating Recommended; Ratings: -; Applications: General Purpose; Mounting Type: Surface Mount, MLCC; Package / Case: 0603 (1608 Metric); Size / Dimension: 0.063" L x 0.031" W (1.60mm x 0.80mm); Height - Seated (Max): -; Thickness (Max): 0.022" (0.55mm); Lead Spacing: -; Lead Style: -
C7 = GRM153R60J475ME15D: as C3 on sheet ESP32_C5; Datasheets: http://psearch.en.murata.com/capacitor/product/GRM153R60J475ME15%23.pdf; Image: //media.digikey.com/Renders/Murata%20Renders/ZRB-SERIES-0402.jpg; Digi-Key Part Number: 490-13232-1-ND; Part Number: GRM153R60J475ME15D; Quantity Available: 30412; @ qty: 0; Packaging: Cut Tape (CT); Series: GRM; Part Status: Active; Value: 4.7µF; Voltage: 6.3V; Temperature Coefficient: X5R; Operating Temperature: -55°C ~ 85°C; Features: Derating Recommended; Ratings: -; Applications: General Purpose; Mounting Type: Surface Mount, MLCC; Package / Case: 0402 (1005 Metric); Size / Dimension: 0.039" L x 0.020" W (1.00mm x 0.50mm); Height - Seated (Max): -; Thickness (Max): 0.013" (0.33mm); Lead Spacing: -; Lead Style: -
C8 = GCM155R71C104KA55D: as C1 on sheet [0]Top; Datasheets: http://www.murata.com/~/media/webrenewal/support/library/catalog/products/capacitor/mlcc/c03e.ashx; Image: //media.digikey.com/Renders/Murata%20Renders/ZRB-SERIES-0402.jpg; Digi-Key Part Number: 490-4759-1-ND; Part Number: GCM155R71C104KA55D; Quantity Available: 734194; @ qty: 0; Packaging: Cut Tape (CT); Series: GCM; Part Status: Active; Value: 0.10µF; Voltage: 16V; Temperature Coefficient: X7R; Operating Temperature: -55°C ~ 125°C; Features: -; Ratings: AEC-Q200; Applications: Automotive; Mounting Type: Surface Mount, MLCC; Package / Case: 0402 (1005 Metric); Size / Dimension: 0.039" L x 0.020" W (1.00mm x 0.50mm); Height - Seated (Max): -; Thickness (Max): 0.022" (0.55mm); Lead Spacing: -; Lead Style: -
C9 = GCM155C71A105KE38D: as C5 on sheet ESP32_C5; Datasheets: http://www.murata.com/~/media/webrenewal/support/library/catalog/products/capacitor/mlcc/c03e.ashx; Image: //media.digikey.com/Renders/Murata%20Renders/ZRB-SERIES-0402.jpg; Digi-Key Part Number: 490-13409-1-ND; Part Number: GCM155C71A105KE38D; Quantity Available: 7240; @ qty: 0; Packaging: Cut Tape (CT); Series: GCM; Part Status: Active; Value: 1µF; Voltage: 10V; Temperature Coefficient: X7S; Operating Temperature: -55°C ~ 125°C; Features: -; Ratings: AEC-Q200; Applications: Automotive; Mounting Type: Surface Mount, MLCC; Package / Case: 0402 (1005 Metric); Size / Dimension: 0.039" L x 0.020" W (1.00mm x 0.50mm); Height - Seated (Max): -; Thickness (Max): 0.022" (0.55mm); Lead Spacing: -; Lead Style: -
Q3 = DMN67D7L-13: as Q1 on sheet ESP32_C5; Datasheet Link: https://www.diodes.com/assets/Package-Files/SOT23.pdf; Height: 1.1mm; Manufacturer_Part_Number: DMN67D7L-13; Mouser Part Number: 621-DMN67D7L-13; Mouser Price/Stock: https://www.mouser.co.uk/ProductDetail/Diodes-Incorporated/DMN67D7L-13?qs=W0yvOO0ixfHR5TrLcSFuNw%3D%3D; Arrow Part Number: DMN67D7L-13; Arrow Price/Stock: https://www.arrow.com/en/products/dmn67d7l-13/diodes-incorporated?region=nac; Value: DMN67D7L-13
R5 R6 = ERJ-2RKF4701X: RES SMD 4.7K OHM 1% 1/10W 0402; Manufacturer: Panasonic Electronic Components; Factory Stock: 0; Unit Price (USD): 0.00496; @ qty: 1500; Minimum Quantity: 1; Power (Watts): 0.1W, 1/10W; Temperature Coefficient: ±100ppm/°C; Part Number: ERJ-2RKF4701X; Datasheets: http://industrial.panasonic.com/www-cgi/jvcr13pz.cgi?E+PZ+3+AOA0002+ERJ2RKF4701X+7+WW; Image: //media.digikey.com/Photos/Panasonic%20Photos/ERJ-PA2-Series.jpg; Digi-Key Part Number: P4.70KLCT-ND; Quantity Available: 1881807; Packaging: Cut Tape (CT); Series: ERJ; Part Status: Active; Value: 4.7k; Tolerance: ±1%; Composition: Thick Film; Features: Automotive AEC-Q200; Operating Temperature: -55°C ~ 155°C; Package / Case: 0402 (1005 Metric); Supplier Device Package: 0402; Size / Dimension: 0.039" L x 0.020" W (1.00mm x 0.50mm); Height - Seated (Max): 0.016" (0.40mm); Number of Terminations: 2; Failure Rate: -
R7-R9 = ERJ-2RKF1002X: as R1 on sheet ESP32_C5; Part Number: ERJ-2RKF1002X; Datasheets: http://industrial.panasonic.com/www-cgi/jvcr13pz.cgi?E+PZ+3+AOA0002+ERJ2RKF1002X+7+WW; Image: //media.digikey.com/Photos/Panasonic%20Photos/ERJ-PA2-Series.jpg; Digi-Key Part Number: P10.0KLCT-ND; Quantity Available: 9922786; Packaging: Cut Tape (CT); Series: ERJ; Part Status: Active; Value: 10k; Tolerance: ±1%; Composition: Thick Film; Features: Automotive AEC-Q200; Operating Temperature: -55°C ~ 155°C; Package / Case: 0402 (1005 Metric); Supplier Device Package: 0402; Size / Dimension: 0.039" L x 0.020" W (1.00mm x 0.50mm); Height - Seated (Max): 0.016" (0.40mm); Number of Terminations: 2; Failure Rate: -
SW3 SW4 = SKRKAEE020: as SW1 on sheet ESP32_C5; Datasheet Link: http://www.alps.com/prod/info/J/HTML/Tact/SurfaceMount/SKRK/SKRKAEE020.html; Height: 2mm; Manufacturer_Part_Number: SKRKAEE020; Mouser Part Number: 688-SKRKAEE020; Mouser Price/Stock: https://www.mouser.co.uk/ProductDetail/Alps-Alpine/SKRKAEE020?qs=MrosSN5%252BUQW89XjXIp8Ugw%3D%3D; Value: SKRKAEE020
U2 = ESP32-S3-WROOM-1U-N16R8: RF System on a Chip - SoC SMD IC ESP32-S3, dual-core MCU, Wi-Fi 2.4G & BLE 5.0 combo, QFN 56-pin, 7*7 mm; Manufacturer_Name: Espressif Systems; Datasheet Link: https://www.espressif.com/sites/default/files/documentation/esp32-s3-wroom-1_wroom-1u_datasheet_en.pdf; Height: 3.35mm; Manufacturer_Part_Number: ESP32-S3-WROOM-1U-N16R8; Mouser Part Number: 356-ESP32S3WM1UN16R8; Mouser Price/Stock: https://www.mouser.co.uk/ProductDetail/Espressif-Systems/ESP32-S3-WROOM-1U-N16R8?qs=Li%252BoUPsLEns6V0Pr5KRJtw%3D%3D; Value: ESP32-S3-WROOM-1U-N16R8

## Sheet GPIO_Expander.SchDoc
size A4; SheetNumber: 4; SheetTotal: 7
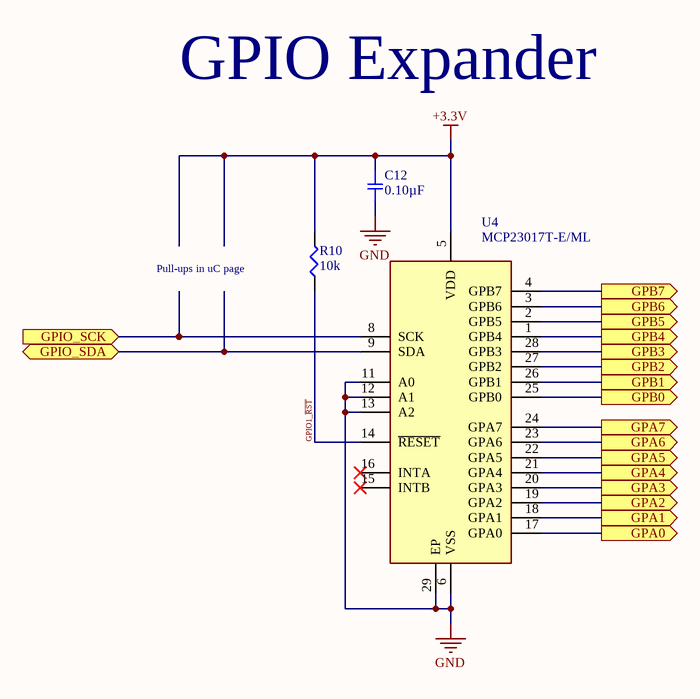
[diagram p3: GPIO_Expander.SchDoc]

### Parts
C12  0.10µF  [SMD-0402C]
R10  10k  [SMD-0402-RES]
U4  MCP23017T-E/ML  [QFN65P600X600X100-29N-D]

### Ports
GPA0 (out), GPA1 (out), GPA2 (out), GPA3 (out), GPA4 (out), GPA5 (out), GPA6 (out), GPA7 (out), GPB0 (out), GPB1 (out), GPB2 (out), GPB3 (out), GPB4 (out), GPB5 (out), GPB6 (out), GPB7 (out), GPIO_SCK (in), GPIO_SDA (bidir)

### Nets
+3.3V: C12.1 R10.2 U4.5(VDD)
GND: C12.2 U4.6(VSS) U4.11(A0) U4.12(A1) U4.13(A2) U4.29(EP)
C5_~{CS}: U4.24(GPA7) ; port GPA7
C5_RST: U4.23(GPA6) ; port GPA6
GPIO1_~{RST}: R10.1 U4.14(~{RESET})
LCD_BL: U4.4(GPB7) ; port GPB7
LCD_~{CS}: U4.2(GPB5) ; port GPB5
LCD_D/C: U4.1(GPB4) ; port GPB4
LCD_~{RST}: U4.3(GPB6) ; port GPB6
MODBUS_DE: U4.25(GPB0) ; port GPB0
RELAY1: U4.22(GPA5) ; port GPA5
RELAY2: U4.21(GPA4) ; port GPA4
RELAY3: U4.20(GPA3) ; port GPA3
RELAY4: U4.19(GPA2) ; port GPA2
RELAY5: U4.18(GPA1) ; port GPA1
RELAY6: U4.17(GPA0) ; port GPA0
S3_SCL: U4.8(SCK) ; port GPIO_SCK
S3_SDA: U4.9(SDA) ; port GPIO_SDA
SX1262_~{CS}: U4.28(GPB3) ; port GPB3
SX1262_~{RST}: U4.27(GPB2) ; port GPB2
SX1262_RFSW: U4.26(GPB1) ; port GPB1

Not connected (* = marked no-connect by the designer): U4 7(NC_1) 10(NC_2) 15(INTB)* 16(INTA)*

### Notes on the sheet
- GPIO Expander
- (near R10) Pull-ups in uC page

### Library data of the parts
C12 = GCM155R71C104KA55D: as C1 on sheet [0]Top; Datasheets: http://www.murata.com/~/media/webrenewal/support/library/catalog/products/capacitor/mlcc/c03e.ashx; Image: //media.digikey.com/Renders/Murata%20Renders/ZRB-SERIES-0402.jpg; Digi-Key Part Number: 490-4759-1-ND; Part Number: GCM155R71C104KA55D; Quantity Available: 734194; @ qty: 0; Packaging: Cut Tape (CT); Series: GCM; Part Status: Active; Value: 0.10µF; Voltage: 16V; Temperature Coefficient: X7R; Operating Temperature: -55°C ~ 125°C; Features: -; Ratings: AEC-Q200; Applications: Automotive; Mounting Type: Surface Mount, MLCC; Package / Case: 0402 (1005 Metric); Size / Dimension: 0.039" L x 0.020" W (1.00mm x 0.50mm); Height - Seated (Max): -; Thickness (Max): 0.022" (0.55mm); Lead Spacing: -; Lead Style: -
R10 = ERJ-2RKF1002X: as R1 on sheet ESP32_C5; Part Number: ERJ-2RKF1002X; Datasheets: http://industrial.panasonic.com/www-cgi/jvcr13pz.cgi?E+PZ+3+AOA0002+ERJ2RKF1002X+7+WW; Image: //media.digikey.com/Photos/Panasonic%20Photos/ERJ-PA2-Series.jpg; Digi-Key Part Number: P10.0KLCT-ND; Quantity Available: 9922786; Packaging: Cut Tape (CT); Series: ERJ; Part Status: Active; Value: 10k; Tolerance: ±1%; Composition: Thick Film; Features: Automotive AEC-Q200; Operating Temperature: -55°C ~ 155°C; Package / Case: 0402 (1005 Metric); Supplier Device Package: 0402; Size / Dimension: 0.039" L x 0.020" W (1.00mm x 0.50mm); Height - Seated (Max): 0.016" (0.40mm); Number of Terminations: 2; Failure Rate: -
U4 = MCP23017T-E/ML: Interface - I/O Expanders 16bit Input/Output Exp I2C interface; Manufacturer_Name: Microchip; Datasheet Link: https://datasheet.datasheetarchive.com/originals/distributors/SFDatasheet-4/sf-00090057.pdf; Height: 1mm; Manufacturer_Part_Number: MCP23017T-E/ML; Mouser Part Number: 579-MCP23017T-E/ML; Mouser Price/Stock: https://www.mouser.co.uk/ProductDetail/Microchip-Technology/MCP23017T-E-ML?qs=usxtMOJb1RwLvxs2MXknpg%3D%3D; Arrow Part Number: MCP23017T-E/ML; Arrow Price/Stock: https://www.arrow.com/en/products/mcp23017t-eml/microchip-technology.html?utm_currency=USD&region=nac; Value: MCP23017T-E/ML

## Sheet SX1262_Radio.SchDoc
size A4; SheetNumber: 7; SheetTotal: 7
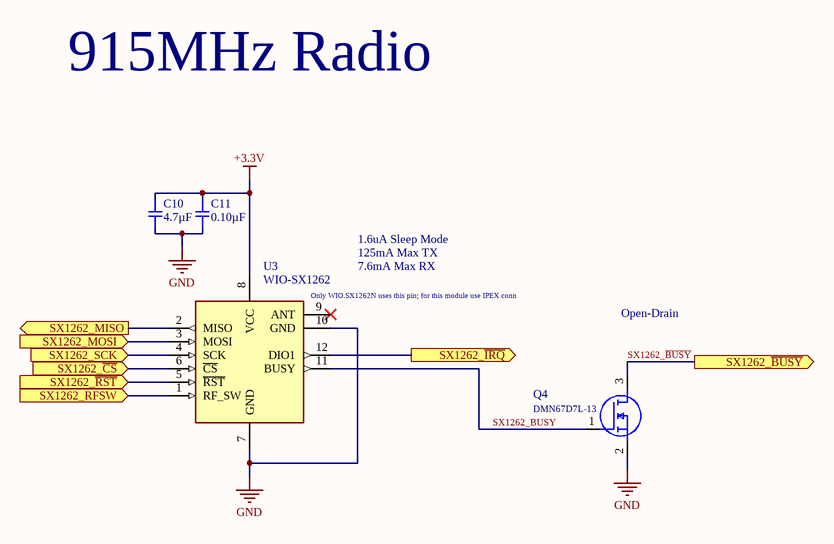
[diagram p4: SX1262_Radio.SchDoc]

### Parts
C10  4.7µF  [SMD-0402C]
C11  0.10µF  [SMD-0402C]
Q4  DMN67D7L-13  [DMN67D7L13]
U3  WIO-SX1262  [114993390]

### Ports
SX1262_MISO (out), SX1262_MOSI (in), SX1262_RFSW (in), SX1262_SCK (in), SX1262_~{BUSY} (out), SX1262_~{CS} (in), SX1262_~{IRQ} (out), SX1262_~{RST} (in)

### Nets
+3.3V: C10.1 C11.1 U3.8(VCC)
GND: C10.2 C11.2 Q4.2(S) U3.7(GND) U3.10(GND)
S3_MISO: U3.2(MISO) ; port SX1262_MISO
S3_MOSI: U3.3(MOSI) ; port SX1262_MOSI
S3_SCK: U3.4(SCK) ; port SX1262_SCK
SX1262_~{BUSY}: Q4.3(D) ; port SX1262_~{BUSY}
SX1262_BUSY: Q4.1(G) U3.11(BUSY)
SX1262_~{CS}: U3.6(~{CS}) ; port SX1262_~{CS}
SX1262_~{IRQ}: U3.12(DIO1) ; port SX1262_~{IRQ}
SX1262_~{RST}: U3.5(~{RST}) ; port SX1262_~{RST}
SX1262_RFSW: U3.1(RF_SW) ; port SX1262_RFSW

Not connected (* = marked no-connect by the designer): U3 9(ANT)*

### Notes on the sheet
- 915MHz Radio
- 1.6uA Sleep Mode
- 125mA Max TX
- 7.6mA Max RX
- (near U3) Only WIO.SX1262N uses this pin; for this module use IPEX conn
- Open-Drain

### Library data of the parts
C10 = GRM153R60J475ME15D: as C3 on sheet ESP32_C5; Datasheets: http://psearch.en.murata.com/capacitor/product/GRM153R60J475ME15%23.pdf; Image: //media.digikey.com/Renders/Murata%20Renders/ZRB-SERIES-0402.jpg; Digi-Key Part Number: 490-13232-1-ND; Part Number: GRM153R60J475ME15D; Quantity Available: 30412; @ qty: 0; Packaging: Cut Tape (CT); Series: GRM; Part Status: Active; Value: 4.7µF; Voltage: 6.3V; Temperature Coefficient: X5R; Operating Temperature: -55°C ~ 85°C; Features: Derating Recommended; Ratings: -; Applications: General Purpose; Mounting Type: Surface Mount, MLCC; Package / Case: 0402 (1005 Metric); Size / Dimension: 0.039" L x 0.020" W (1.00mm x 0.50mm); Height - Seated (Max): -; Thickness (Max): 0.013" (0.33mm); Lead Spacing: -; Lead Style: -
C11 = GCM155R71C104KA55D: as C1 on sheet [0]Top; Datasheets: http://www.murata.com/~/media/webrenewal/support/library/catalog/products/capacitor/mlcc/c03e.ashx; Image: //media.digikey.com/Renders/Murata%20Renders/ZRB-SERIES-0402.jpg; Digi-Key Part Number: 490-4759-1-ND; Part Number: GCM155R71C104KA55D; Quantity Available: 734194; @ qty: 0; Packaging: Cut Tape (CT); Series: GCM; Part Status: Active; Value: 0.10µF; Voltage: 16V; Temperature Coefficient: X7R; Operating Temperature: -55°C ~ 125°C; Features: -; Ratings: AEC-Q200; Applications: Automotive; Mounting Type: Surface Mount, MLCC; Package / Case: 0402 (1005 Metric); Size / Dimension: 0.039" L x 0.020" W (1.00mm x 0.50mm); Height - Seated (Max): -; Thickness (Max): 0.022" (0.55mm); Lead Spacing: -; Lead Style: -
Q4 = DMN67D7L-13: as Q1 on sheet ESP32_C5; Datasheet Link: https://www.diodes.com/assets/Package-Files/SOT23.pdf; Height: 1.1mm; Manufacturer_Part_Number: DMN67D7L-13; Mouser Part Number: 621-DMN67D7L-13; Mouser Price/Stock: https://www.mouser.co.uk/ProductDetail/Diodes-Incorporated/DMN67D7L-13?qs=W0yvOO0ixfHR5TrLcSFuNw%3D%3D; Arrow Part Number: DMN67D7L-13; Arrow Price/Stock: https://www.arrow.com/en/products/dmn67d7l-13/diodes-incorporated?region=nac; Value: DMN67D7L-13
U3 = WIO-SX1262: RF Modules Wio-SX1262 Wireless Module (Bulk), SX1262 embedded, supports LoRa&LoRaWAN on EU868 & US915; Manufacturer_Name: Seeed Studio; Datasheet Link: https://www.mouser.com/pdfDocs/Wio-SX1262module-Datasheet.pdf; Height: 3.15mm; Manufacturer_Part_Number: 114993390; Mouser Part Number: 713-114993390; Mouser Price/Stock: https://www.mouser.co.uk/ProductDetail/Seeed-Studio/114993390?qs=NeOn4crkEuu9JWV37oJsXg%3D%3D; Value: WIO-SX1262

## Sheet ExpansionBoard.SchDoc
size A4; SheetNumber: 6; SheetTotal: 7
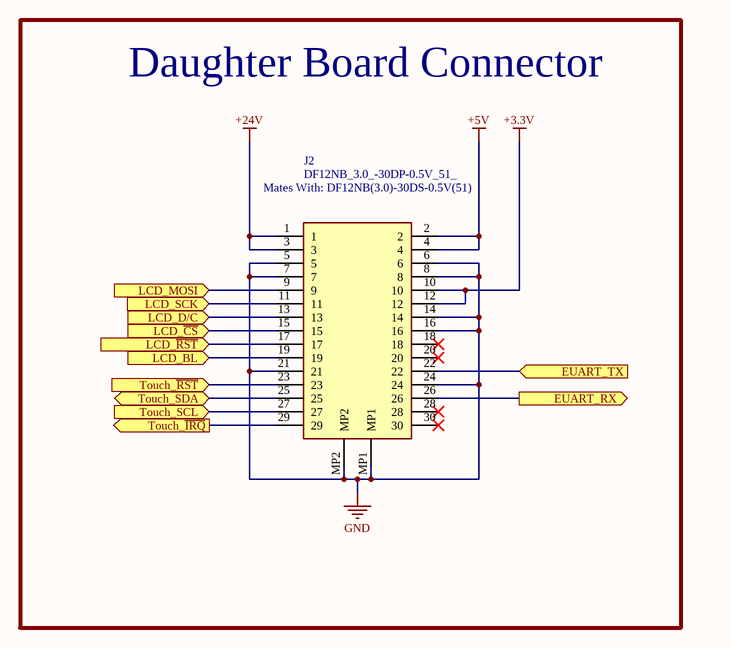
[diagram p5: ExpansionBoard.SchDoc]

### Parts
J2  DF12NB_3.0_-30DP-0.5V_51_  [DF12NB3030DP05V51]

### Blocks framed on the sheet
Daughter Board Connector: J2

### Ports
EUART_RX (out), EUART_TX (in), LCD_BL (in), LCD_D/C (in), LCD_MOSI (in), LCD_SCK (in), LCD_~{CS} (in), LCD_~{RST} (in), Touch_SCL (in), Touch_SDA (bidir), Touch_~{IRQ} (out), Touch_~{RST} (in)

### Nets
+3.3V: J2.10 J2.12
+5V: J2.2 J2.4
+24V: J2.1 J2.3
GND: J2.5 J2.6 J2.7 J2.8 J2.14 J2.16 J2.21 J2.24 J2.MP1 J2.MP2
EUART_RX: J2.26 ; port EUART_RX
EUART_TX: J2.22 ; port EUART_TX
LCD_BL: J2.19 ; port LCD_BL
LCD_~{CS}: J2.15 ; port LCD_~{CS}
LCD_D/C: J2.13 ; port LCD_D/C
LCD_MOSI: J2.9 ; port LCD_MOSI
LCD_~{RST}: J2.17 ; port LCD_~{RST}
LCD_SCK: J2.11 ; port LCD_SCK
Touch_~{IRQ}: J2.29 ; port Touch_~{IRQ}
Touch_~{RST}: J2.23 ; port Touch_~{RST}
Touch_SCL: J2.27 ; port Touch_SCL
Touch_SDA: J2.25 ; port Touch_SDA

Not connected (* = marked no-connect by the designer): J2 18* 20* 28* 30*

### Notes on the sheet
- (near J2) Mates With: DF12NB(3.0)-30DS-0.5V(51)

### Library data of the parts
J2 = DF12NB_3.0_-30DP-0.5V_51_: Connector; Manufacturer_Name: Hirose; Manufacturer_Part_Number: DF12NB(3.0)-30DP-0.5V(51); Datasheet Link: https://www.hirose.com/en/product/document?clcode=CL0537-0389-0-51&productname=DF12NB(3.0)-30DP-0.5V(51)&series=DF12N&documenttype=2DDrawing&lang=en&documentid=0001367354; Height: 2.5mm; Mouser Part Number: 798-DF12NB3030DP0551; Mouser Price/Stock: https://www.mouser.co.uk/ProductDetail/Hirose-Connector/DF12NB3.0-30DP-0.5V51?qs=DPoM0jnrROVGT6JTbeYOKw%3D%3D

## Sheet WS2812B.SchDoc
size A4; SheetNumber: 14; SheetTotal: 15
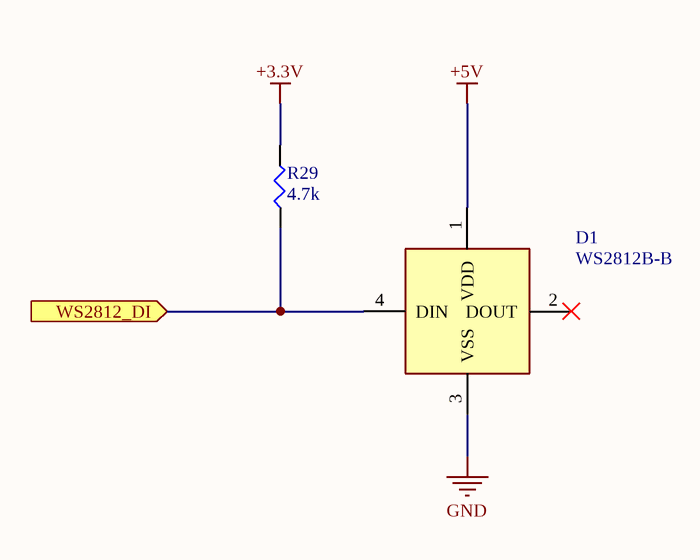
[diagram p6: WS2812B.SchDoc]

### Parts
D1  WS2812B-B  [WS2812BB]
R29  4.7k  [SMD-0402-RES]

### Ports
WS2812_DI (in)

### Nets
+3.3V: R29.2
+5V: D1.1(VDD)
GND: D1.3(VSS)
WS2812B_D: D1.4(DIN) R29.1 ; port WS2812_DI

Not connected (* = marked no-connect by the designer): D1 2(DOUT)*

### Library data of the parts
D1 = WS2812B-B: LED; Manufacturer_Name: Worldsemi; Datasheet Link: http://www.world-semi.com/DownLoadFile/111; Height: 1.62mm; Manufacturer_Part_Number: WS2812B-B; Value: WS2812B-B
R29 = ERJ-2RKF4701X: as R5 on sheet ESP32_S3; Part Number: ERJ-2RKF4701X; Datasheets: http://industrial.panasonic.com/www-cgi/jvcr13pz.cgi?E+PZ+3+AOA0002+ERJ2RKF4701X+7+WW; Image: //media.digikey.com/Photos/Panasonic%20Photos/ERJ-PA2-Series.jpg; Digi-Key Part Number: P4.70KLCT-ND; Quantity Available: 1881807; Packaging: Cut Tape (CT); Series: ERJ; Part Status: Active; Value: 4.7k; Tolerance: ±1%; Composition: Thick Film; Features: Automotive AEC-Q200; Operating Temperature: -55°C ~ 155°C; Package / Case: 0402 (1005 Metric); Supplier Device Package: 0402; Size / Dimension: 0.039" L x 0.020" W (1.00mm x 0.50mm); Height - Seated (Max): 0.016" (0.40mm); Number of Terminations: 2; Failure Rate: -

## Sheet EnvironmentalSensor.SchDoc
size A4; SheetNumber: 8; SheetTotal: 15
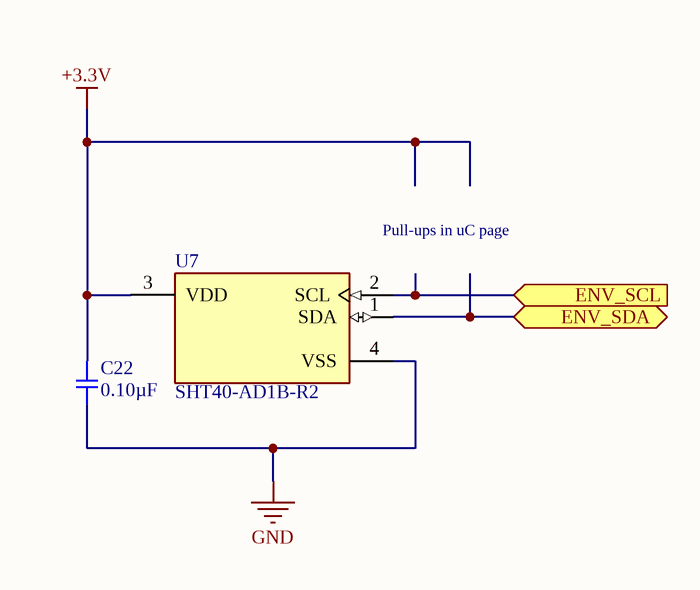
[diagram p7: EnvironmentalSensor.SchDoc]

### Parts
C22  0.10µF  [SMD-0402C]
U7  SHT40-AD1B-R2  [FP-SHT40-AD1B-R2-MFG]

### Ports
ENV_SCL (in), ENV_SDA (bidir)

### Nets
+3.3V: C22.1 U7.3(VDD)
GND: C22.2 U7.4(VSS)
S3_SCL: U7.2(SCL) ; port ENV_SCL
S3_SDA: U7.1(SDA) ; port ENV_SDA

### Notes on the sheet
- (near U7) Pull-ups in uC page

### Library data of the parts
C22 = GCM155R71C104KA55D: as C1 on sheet [0]Top; Datasheets: http://www.murata.com/~/media/webrenewal/support/library/catalog/products/capacitor/mlcc/c03e.ashx; Image: //media.digikey.com/Renders/Murata%20Renders/ZRB-SERIES-0402.jpg; Digi-Key Part Number: 490-4759-1-ND; Part Number: GCM155R71C104KA55D; Quantity Available: 734194; @ qty: 0; Packaging: Cut Tape (CT); Series: GCM; Part Status: Active; Value: 0.10µF; Voltage: 16V; Temperature Coefficient: X7R; Operating Temperature: -55°C ~ 125°C; Features: -; Ratings: AEC-Q200; Applications: Automotive; Mounting Type: Surface Mount, MLCC; Package / Case: 0402 (1005 Metric); Size / Dimension: 0.039" L x 0.020" W (1.00mm x 0.50mm); Height - Seated (Max): -; Thickness (Max): 0.022" (0.55mm); Lead Spacing: -; Lead Style: -
U7 = CMP-144040-000008-1: SENSOR HUMIDITY 100 RH SMD; Value: SHT40-AD1B-R2

## Sheet GPIO_Expander2.SchDoc
size A4; SheetNumber: 5; SheetTotal: 7
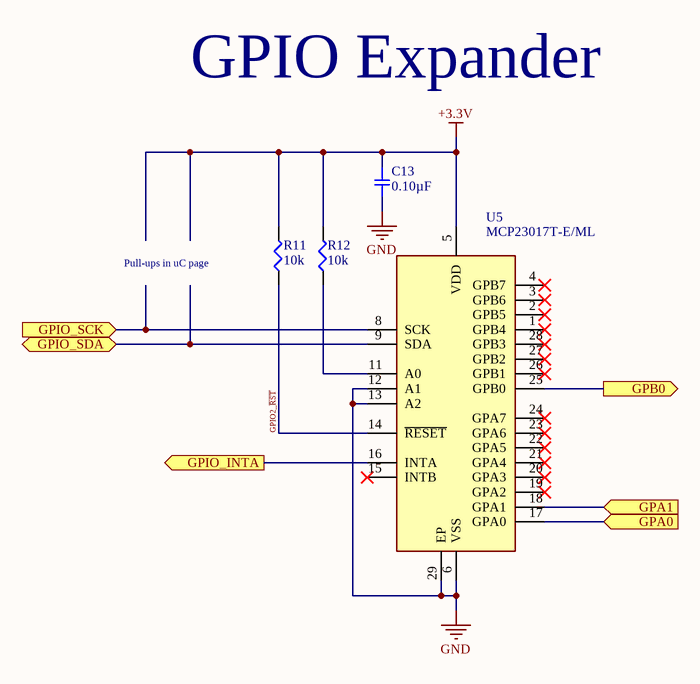
[diagram p8: GPIO_Expander2.SchDoc]

### Parts
C13  0.10µF  [SMD-0402C]
R11  10k  [SMD-0402-RES]
R12  10k  [SMD-0402-RES]
U5  MCP23017T-E/ML  [QFN65P600X600X100-29N-D]

### Ports
GPA0 (in), GPA1 (in), GPB0 (out), GPIO_INTA (out), GPIO_SCK (in), GPIO_SDA (bidir)

### Nets
+3.3V: C13.1 R11.2 R12.2 U5.5(VDD)
GND: C13.2 U5.6(VSS) U5.12(A1) U5.13(A2) U5.29(EP)
GPIO2_~{RST}: R11.1 U5.14(~{RESET})
NetR12_1: R12.1 U5.11(A0)
NetU5_8: U5.8(SCK) ; port GPIO_SCK
NetU5_9: U5.9(SDA) ; port GPIO_SDA
NetU5_16: U5.16(INTA) ; port GPIO_INTA
NetU5_17: U5.17(GPA0) ; port GPA0
NetU5_18: U5.18(GPA1) ; port GPA1
NetU5_25: U5.25(GPB0) ; port GPB0

Not connected (* = marked no-connect by the designer): U5 1(GPB4)* 2(GPB5)* 3(GPB6)* 4(GPB7)* 7(NC_1) 10(NC_2) 15(INTB)* 19(GPA2)* 20(GPA3)* 21(GPA4)* 22(GPA5)* 23(GPA6)* 24(GPA7)* 26(GPB1)* 27(GPB2)* 28(GPB3)*

### Notes on the sheet
- GPIO Expander
- (near R11) Pull-ups in uC page

### Library data of the parts
C13 = GCM155R71C104KA55D: as C1 on sheet [0]Top; Datasheets: http://www.murata.com/~/media/webrenewal/support/library/catalog/products/capacitor/mlcc/c03e.ashx; Image: //media.digikey.com/Renders/Murata%20Renders/ZRB-SERIES-0402.jpg; Digi-Key Part Number: 490-4759-1-ND; Part Number: GCM155R71C104KA55D; Quantity Available: 734194; @ qty: 0; Packaging: Cut Tape (CT); Series: GCM; Part Status: Active; Value: 0.10µF; Voltage: 16V; Temperature Coefficient: X7R; Operating Temperature: -55°C ~ 125°C; Features: -; Ratings: AEC-Q200; Applications: Automotive; Mounting Type: Surface Mount, MLCC; Package / Case: 0402 (1005 Metric); Size / Dimension: 0.039" L x 0.020" W (1.00mm x 0.50mm); Height - Seated (Max): -; Thickness (Max): 0.022" (0.55mm); Lead Spacing: -; Lead Style: -
R11 R12 = ERJ-2RKF1002X: as R1 on sheet ESP32_C5; Part Number: ERJ-2RKF1002X; Datasheets: http://industrial.panasonic.com/www-cgi/jvcr13pz.cgi?E+PZ+3+AOA0002+ERJ2RKF1002X+7+WW; Image: //media.digikey.com/Photos/Panasonic%20Photos/ERJ-PA2-Series.jpg; Digi-Key Part Number: P10.0KLCT-ND; Quantity Available: 9922786; Packaging: Cut Tape (CT); Series: ERJ; Part Status: Active; Value: 10k; Tolerance: ±1%; Composition: Thick Film; Features: Automotive AEC-Q200; Operating Temperature: -55°C ~ 155°C; Package / Case: 0402 (1005 Metric); Supplier Device Package: 0402; Size / Dimension: 0.039" L x 0.020" W (1.00mm x 0.50mm); Height - Seated (Max): 0.016" (0.40mm); Number of Terminations: 2; Failure Rate: -
U5 = MCP23017T-E/ML: as U4 on sheet GPIO_Expander; Datasheet Link: https://datasheet.datasheetarchive.com/originals/distributors/SFDatasheet-4/sf-00090057.pdf; Height: 1mm; Manufacturer_Part_Number: MCP23017T-E/ML; Mouser Part Number: 579-MCP23017T-E/ML; Mouser Price/Stock: https://www.mouser.co.uk/ProductDetail/Microchip-Technology/MCP23017T-E-ML?qs=usxtMOJb1RwLvxs2MXknpg%3D%3D; Arrow Part Number: MCP23017T-E/ML; Arrow Price/Stock: https://www.arrow.com/en/products/mcp23017t-eml/microchip-technology.html?utm_currency=USD&region=nac; Value: MCP23017T-E/ML

## Nets that join several sheets
+3.3V: [0]Top (J3.1), ESP32_C5 (7 pins), ESP32_S3 (8 pins), GPIO_Expander (C12.1 R10.2 U4.5), SX1262_Radio (C10.1 C11.1 U3.8), ExpansionBoard (J2.10 J2.12), WS2812B (R29.2), EnvironmentalSensor (C22.1 U7.3), GPIO_Expander2 (C13.1 R11.2 R12.2 U5.5)
+5V: [0]Top (C1.1 J1.5 J3.3), ExpansionBoard (J2.2 J2.4), WS2812B (D1.1)
+24V: [0]Top (J3.5), ExpansionBoard (J2.1 J2.3)
GND: [0]Top (7 pins), ESP32_C5 (14 pins), ESP32_S3 (19 pins), GPIO_Expander (6 pins), SX1262_Radio (5 pins), ExpansionBoard (10 pins), WS2812B (D1.3), EnvironmentalSensor (C22.2 U7.4), GPIO_Expander2 (5 pins)
C5_BOOT: [0]Top (J1.3), ESP32_C5 (R3.1 SW2.1 U1.15)
C5_~{CS}: ESP32_C5 (U1.6), GPIO_Expander (U4.24)
C5_EN: [0]Top (J1.4), ESP32_C5 (5 pins)
C5_~{IRQ}: ESP32_C5 (Q1.3), ESP32_S3 (U2.25)
C5_RST: ESP32_C5 (Q2.1 R4.2), GPIO_Expander (U4.23)
C5_UART_RX: [0]Top (J1.2), ESP32_C5 (U1.24)
C5_UART_TX: [0]Top (J1.1), ESP32_C5 (U1.25)
CAN_RX: [0]Top (J5.7), ESP32_S3 (U2.17)
CAN_TX: [0]Top (J5.8), ESP32_S3 (U2.18)
Clamp_1: [0]Top (J5.1), ESP32_S3 (U2.39)
EUART_RX: ESP32_S3 (U2.9), ExpansionBoard (J2.26)
EUART_TX: ESP32_S3 (U2.8), ExpansionBoard (J2.22)
LCD_BL: GPIO_Expander (U4.4), ExpansionBoard (J2.19)
LCD_~{CS}: GPIO_Expander (U4.2), ExpansionBoard (J2.15)
LCD_D/C: GPIO_Expander (U4.1), ExpansionBoard (J2.13)
LCD_MOSI: ESP32_S3 (U2.10), ExpansionBoard (J2.9)
LCD_~{RST}: GPIO_Expander (U4.3), ExpansionBoard (J2.17)
LCD_SCK: ESP32_S3 (U2.11), ExpansionBoard (J2.11)
MODBUS_D: [0]Top (J5.3), ESP32_S3 (U2.20)
MODBUS_DE: [0]Top (J5.4), GPIO_Expander (U4.25)
MODBUS_R: [0]Top (J5.5), ESP32_S3 (U2.19)
RELAY1: [0]Top (J4.7), GPIO_Expander (U4.22)
RELAY2: [0]Top (J4.6), GPIO_Expander (U4.21)
RELAY3: [0]Top (J4.5), GPIO_Expander (U4.20)
RELAY4: [0]Top (J4.3), GPIO_Expander (U4.19)
RELAY5: [0]Top (J4.2), GPIO_Expander (U4.18)
RELAY6: [0]Top (J4.1), GPIO_Expander (U4.17)
RTC_INT: [0]Top (J5.2), ESP32_S3 (U2.12)
S3_BOOT: [0]Top (J1.8), ESP32_S3 (R8.1 SW4.1 U2.27)
S3_EN: [0]Top (J1.7), ESP32_S3 (5 pins)
S3_MISO: ESP32_C5 (U1.8), ESP32_S3 (U2.31), SX1262_Radio (U3.2)
S3_MOSI: ESP32_C5 (U1.10), ESP32_S3 (U2.32), SX1262_Radio (U3.3)
S3_SCK: ESP32_C5 (U1.11), ESP32_S3 (U2.33), SX1262_Radio (U3.4)
S3_SCL: ESP32_S3 (R5.1 U2.34), GPIO_Expander (U4.8), EnvironmentalSensor (U7.2)
S3_SDA: ESP32_S3 (R6.1 U2.35), GPIO_Expander (U4.9), EnvironmentalSensor (U7.1)
S3_UART_RX: [0]Top (J1.9), ESP32_S3 (U2.36)
S3_UART_TX: [0]Top (J1.10), ESP32_S3 (U2.37)
SX1262_~{BUSY}: ESP32_S3 (U2.24), SX1262_Radio (Q4.3)
SX1262_~{CS}: GPIO_Expander (U4.28), SX1262_Radio (U3.6)
SX1262_~{IRQ}: ESP32_S3 (U2.7), SX1262_Radio (U3.12)
SX1262_~{RST}: GPIO_Expander (U4.27), SX1262_Radio (U3.5)
SX1262_RFSW: GPIO_Expander (U4.26), SX1262_Radio (U3.1)
Touch_~{IRQ}: ESP32_S3 (U2.6), ExpansionBoard (J2.29)
Touch_~{RST}: ESP32_S3 (U2.21), ExpansionBoard (J2.23)
Touch_SCL: ESP32_S3 (U2.5), ExpansionBoard (J2.27)
Touch_SDA: ESP32_S3 (U2.4), ExpansionBoard (J2.25)
WS2812B_D: ESP32_S3 (U2.38), WS2812B (D1.4 R29.1)